# Altium project BMS1.PrjPcb
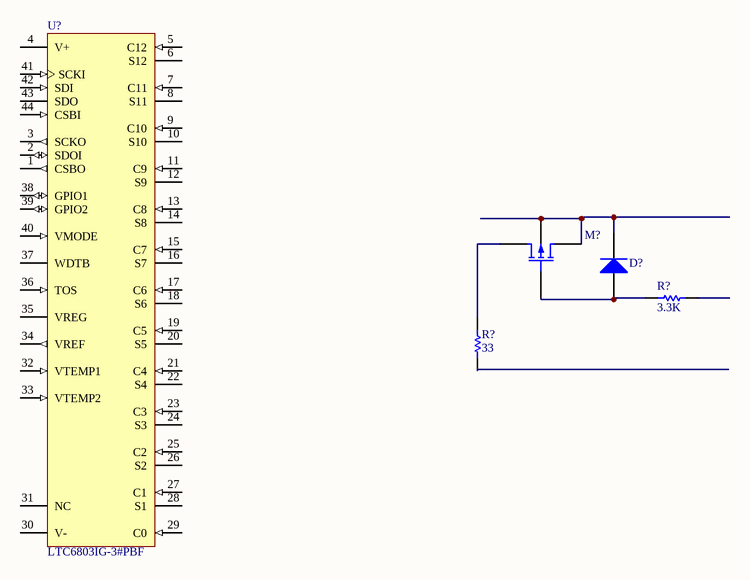
[diagram p0: LMU.SchDoc]
1 sheet, 5 parts. Net scope: global (net labels, ports and power ports of the same name join across sheets).

## Sheet LMU.SchDoc
size A4; SheetNumber: 1; SheetTotal: 1

### Parts
(Parts that share a designator on the sheet are numbered #1, #2 ... from top to bottom, then left to right.)
D?  Diode  (value not drawn)
M?  P-channel MOS1 MOSFET Shichman and Hodges Model  (value not drawn)
R?#1  value 3.3K  (hidden comment: Resistor)
R?#2  value 33  (hidden comment: Resistor)
U?  LTC6803IG-3#PBF  [LT-G-44_N]

### Nets
NetD?_1: D?.1(A) M?.2(G) R?#1.1
NetD?_2: D?.2(K) M?.3(S) M?.4(B)
NetM?_1: M?.1(D) R?#2.1

Not connected (* = marked no-connect by the designer): R?#1 2; R?#2 2; U? 1(CSBO) 2(SDOI) 3(SCKO) 4(V+) 5(C12) 6(S12) 7(C11) 8(S11) 9(C10) 10(S10) 11(C9) 12(S9) 13(C8) 14(S8) 15(C7) 16(S7) 17(C6) 18(S6) 19(C5) 20(S5) 21(C4) 22(S4) 23(C3) 24(S3) 25(C2) 26(S2) 27(C1) 28(S1) 29(C0) 30(V-) 31(NC) 32(VTEMP1) 33(VTEMP2) 34(VREF) 35(VREG) 36(TOS) 37(WDTB) 38(GPIO1) 39(GPIO2) 40(VMODE) 41(SCKI) 42(SDI) 43(SDO) 44(CSBI)

### Library data of the parts
D? = Diode: AF: 1; BV: 0; BV_MAX: 1e99; EG: 1.11; FC: 0.5; IBV: 0.001; ISR: 1e-14; MJSW: 0.33; NTUN: 30; TNOM: 27; XTI: 3; SimulationGenericComponent: True; CJO: 0; CJP: 0; CTA: 0; CTP: 0; FCS: 0.5; FV_MAX: 1e99; IKF: 0; IKR: 0; JSW: 0; JTUN: 0; JTUNSW: 0; KEG: 1; KF: 0; LEVEL: 1; N: 1; NBV: 1; NR: 1; NS: 1; PHP: 1; RS: 0; TCV: 0; TLEV: 0; TLEVC: 0; TM1: 0; TM2: 0; TPB: 0; TPHP: 0; TRS: 0; TRS2: 0; TT: 0; TTT1: 0; TTT2: 0; VJ: 1; XTITUN: 3; IS: 1e-14
M? = MOSFET P-ch Lev1: CBD: 0; FC: 0.5; IS: 1e-14; KP: 2e-05; PB: 0.8; PHI: 0.6; TNOM: 27; SimulationGenericComponent: True; CBS: 0; CGBO: 0; CGDO: 0; CGSO: 0; CJ: 0; CJSW: 0; GAMMA: 0; JS: 0; LAMBDA: 0; LD: 0; MJ: 0.5; MJSW: 0.5; NSS: 0; NSUB: 0; RD: 0; RS: 0; RSH: 0; TOX: 0; TPG: 0; U0: 0; VTO: 0
R?#1 R?#2 = Resistor: TC1: 0; SimulationGenericComponent: True; TC2: 0
U? = CMP-0471-00235-1: Multicell Battery Stack Monitor, 60 V Vin MAX, 44-pin SOP (G-44), -40 to 85 degC, Pb-Free; Manufacturer: Linear Technology; Number of Cells: > 1000 V of stacked Li-Ion cells; Vin Max(V): 60; Battery Chemistry: Li-Ion, Supercapacitors, Multi-Chemistry; ComponentLink3URL: http://cds.linear.com/docs/en/packaging/SSOP_44_05-08-1754.pdf; PackageReference: G-44; ComponentLink3Description: Package Specification; ComponentLink1Description: Manufacturer URL; Mounting Technology: Surface Mount; ComponentLink1URL: http://www.linear.com/; RoHS: TRUE; PackageDescription: 44-Pin Plastic SSOP, Body 12.8 x 5.3 mm, Pitch 0.5 mm; ComponentLink2URL: http://cds.linear.com/docs/en/datasheet/680313fa.pdf; PartNumber: LTC6803IG-3#PBF; ComponentLink2Description: Datasheet; DatasheetVersion: Rev. A; PackageVersion: Rev. Ã˜, 06/2010; Type of Charger: Battery Stack Monitor